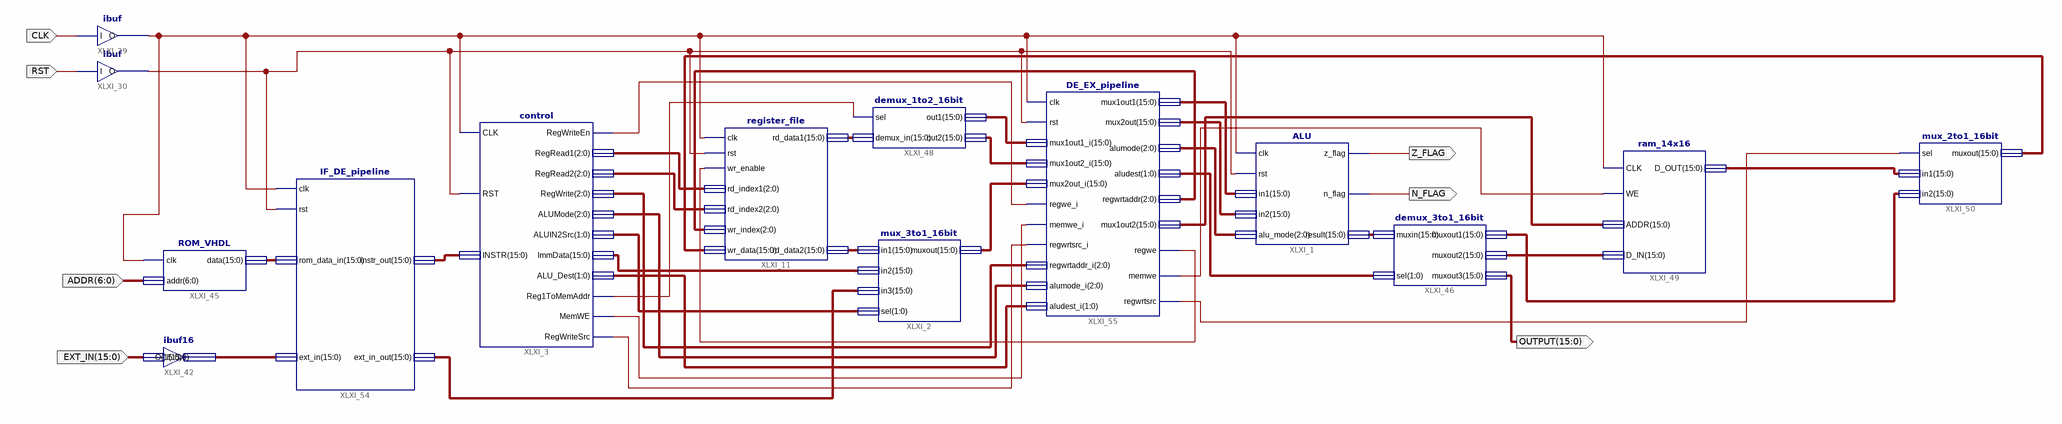
[diagram p0: schematic sheet 1]
// Xilinx ISE schematic cpu_pipelined.sch (spartan3e) as structural Verilog: 14 symbols, 7 ports
module cpu_pipelined (
  input  [6:0] ADDR,
  input  RST,
  input  CLK,
  input  [15:0] EXT_IN,
  output [15:0] OUTPUT,
  output N_FLAG,
  output Z_FLAG
);

  wire XLXN_316, XLXN_454, XLXN_499, XLXN_502, XLXN_503, XLXN_504, XLXN_549, XLXN_550, XLXN_552;
  wire [1:0] XLXN_104, XLXN_501, XLXN_533;
  wire [2:0] XLXN_23, XLXN_24, XLXN_500, XLXN_506, XLXN_532, XLXN_553;
  wire [15:0] ALU_RESULT, EXTIN, EXTIN_OUT, instr_in, instr_out, MEMDATA, MEMOUT, XLXN_4, XLXN_97, XLXN_341,
       XLXN_368, XLXN_494, XLXN_495, XLXN_496, XLXN_530, XLXN_531, XLXN_548, XLXN_551;

  mux_3to1_16bit XLXI_2 (.in1(XLXN_97), .in2(XLXN_4), .in3(EXTIN_OUT), .sel(XLXN_104), .muxout(XLXN_496));
  demux_1to2_16bit XLXI_48 (.sel(XLXN_454), .demux_in(XLXN_341), .out1(XLXN_494), .out2(XLXN_495));
  register_file XLXI_11 (
    .wr_enable(XLXN_552), .rd_index1(XLXN_23), .rd_index2(XLXN_24), .wr_index(XLXN_553), .wr_data(XLXN_551),
    .rd_data2(XLXN_97), .rst(XLXN_499), .clk(XLXN_316), .rd_data1(XLXN_341));
  control XLXI_3 (
    .CLK(XLXN_316), .RST(XLXN_499), .INSTR(instr_out), .RegWriteEn(XLXN_504), .Reg1ToMemAddr(XLXN_454),
    .MemWE(XLXN_502), .RegRead1(XLXN_23), .RegRead2(XLXN_24), .RegWrite(XLXN_506), .ALUMode(XLXN_500),
    .ImmData(XLXN_4), .ALUIN2Src(XLXN_104), .ALU_Dest(XLXN_501), .RegWriteSrc(XLXN_503));
  IF_DE_pipeline XLXI_54 (
    .clk(XLXN_316), .rst(XLXN_499), .rom_data_in(instr_in), .ext_in(EXTIN), .instr_out(instr_out),
    .ext_in_out(EXTIN_OUT));
  ROM_VHDL XLXI_45 (.clk(XLXN_316), .addr(ADDR), .data(instr_in));
  ibuf XLXI_30 (.I(RST), .O(XLXN_499));
  ibuf XLXI_29 (.I(CLK), .O(XLXN_316));
  DE_EX_pipeline XLXI_55 (
    .rst(XLXN_499), .regwrtaddr_i(XLXN_506), .alumode_i(XLXN_500), .aludest_i(XLXN_501), .regwe_i(XLXN_504),
    .memwe_i(XLXN_502), .regwrtsrc_i(XLXN_503), .mux1out1_i(XLXN_494), .mux1out2_i(XLXN_495),
    .mux2out_i(XLXN_496), .clk(XLXN_316), .mux1out1(XLXN_530), .mux2out(XLXN_531), .alumode(XLXN_532),
    .aludest(XLXN_533), .regwrtaddr(XLXN_553), .mux1out2(XLXN_548), .regwe(XLXN_552), .memwe(XLXN_549),
    .regwrtsrc(XLXN_550));
  ram_14x16 XLXI_49 (.CLK(XLXN_316), .WE(XLXN_549), .ADDR(XLXN_548), .D_OUT(MEMOUT), .D_IN(MEMDATA));
  mux_2to1_16bit XLXI_50 (.sel(XLXN_550), .in1(MEMOUT), .in2(XLXN_368), .muxout(XLXN_551));
  demux_3to1_16bit XLXI_46 (
    .muxin(ALU_RESULT), .sel(XLXN_533), .muxout1(XLXN_368), .muxout2(MEMDATA), .muxout3(OUTPUT));
  ALU XLXI_1 (
    .clk(XLXN_316), .rst(XLXN_499), .in1(XLXN_530), .in2(XLXN_531), .alu_mode(XLXN_532), .z_flag(Z_FLAG),
    .n_flag(N_FLAG), .result(ALU_RESULT));
  ibuf16 XLXI_42 (.I(EXT_IN), .O(EXTIN));
endmodule
